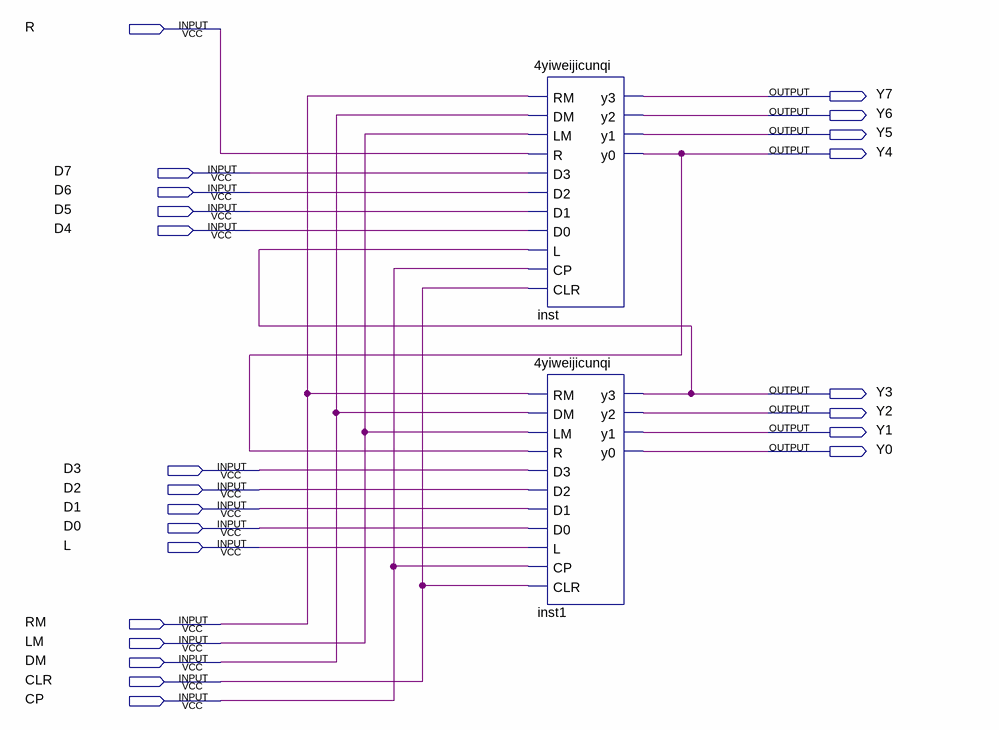
[diagram p0: schematic sheet]
// Quartus schematic 8YIWEIJICUNQI.bdf as structural Verilog: 2 symbols, 23 pins
module \8YIWEIJICUNQI  (
  input  R,
  input  D7,
  input  D6,
  input  D5,
  input  D4,
  input  D3,
  input  D2,
  input  D1,
  input  D0,
  input  L,
  input  RM,
  input  LM,
  input  DM,
  input  CLR,
  input  CP,
  output Y7,
  output Y6,
  output Y5,
  output Y4,
  output Y3,
  output Y2,
  output Y1,
  output Y0
);

  \4yiweijicunqi  inst (
    .RM(RM), .DM(DM), .LM(LM), .R(R), .D3(D7), .D2(D6), .D1(D5), .D0(D4), .L(Y3), .CP(CP), .CLR(CLR),
    .y3(Y7), .y2(Y6), .y1(Y5), .y0(Y4));
  \4yiweijicunqi  inst1 (
    .RM(RM), .DM(DM), .LM(LM), .R(Y4), .D3(D3), .D2(D2), .D1(D1), .D0(D0), .L(L), .CP(CP), .CLR(CLR),
    .y3(Y3), .y2(Y2), .y1(Y1), .y0(Y0));
endmodule
